# Altium schematic sheet Transceiver.SchDoc
size A3; Address1: Address1; Address2: Address2; Address3: Address3; Address4: Address4
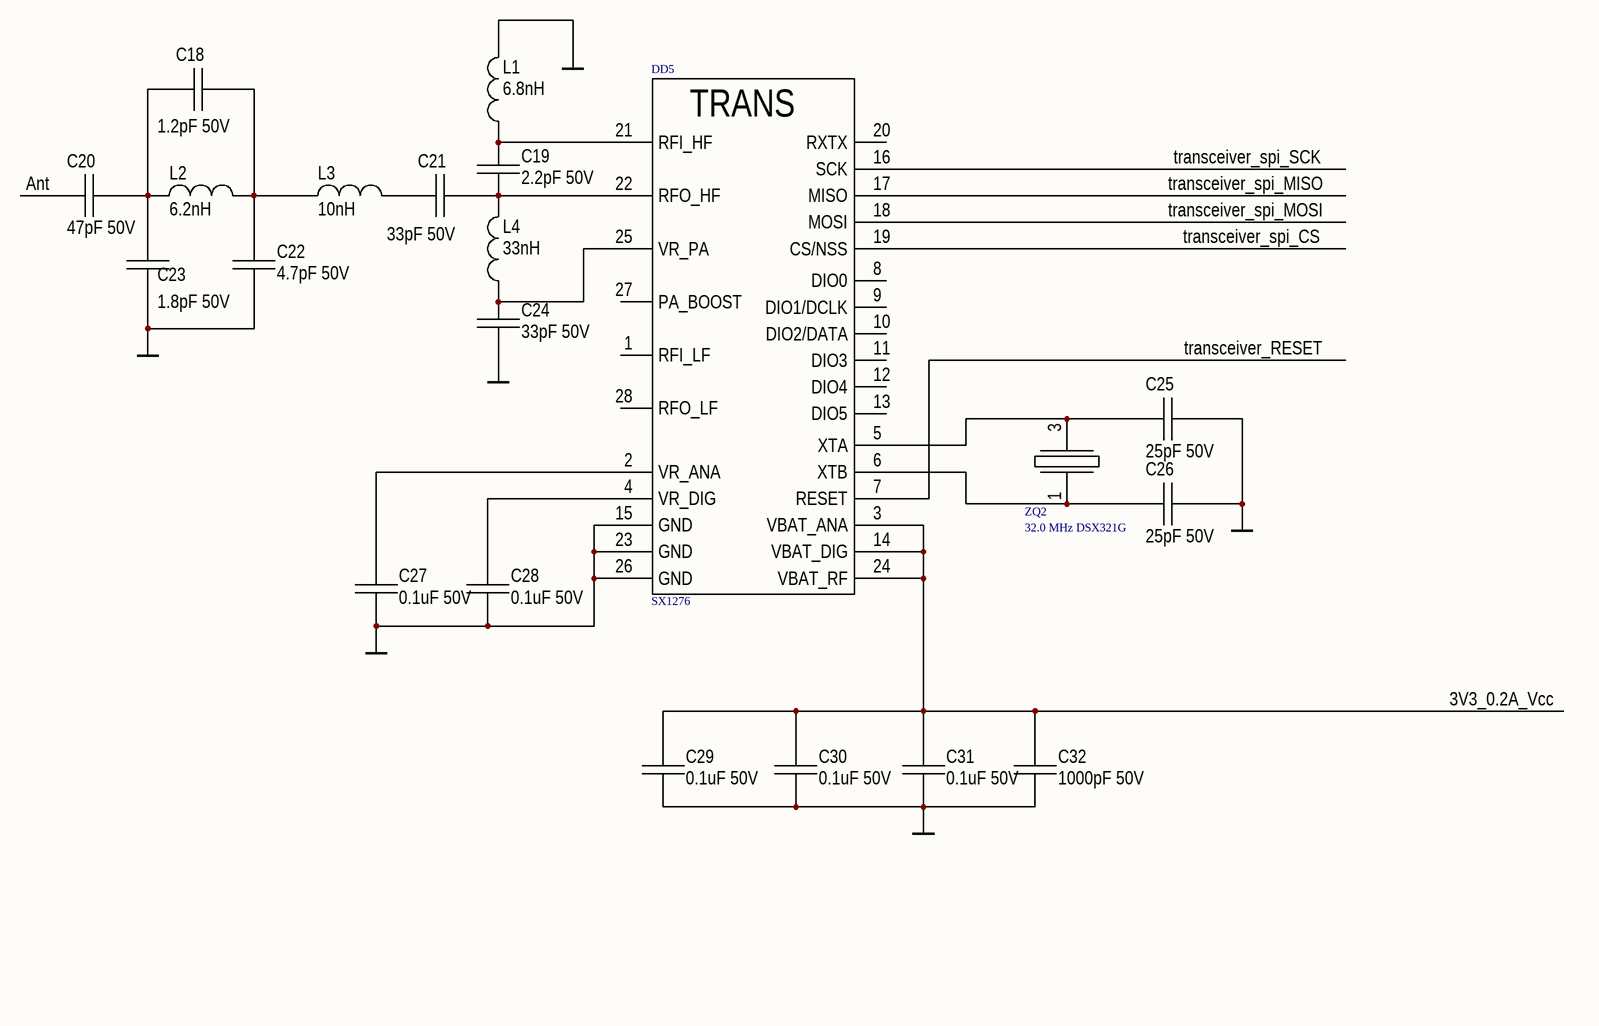
[diagram p0: Transceiver.SchDoc]

## Parts
C18  1.2pF 50V  [0603_CAP]
C19  2.2pF 50V  [0603_CAP]
C20  47pF 50V  [0603_CAP]
C21  33pF 50V  [0603_CAP]
C22  4.7pF 50V  [0603_CAP]
C23  1.8pF 50V  [0603_CAP]
C24  33pF 50V  [0603_CAP]
C25  25pF 50V  [0805_CAP]
C26  25pF 50V  [0805_CAP]
C27  0.1uF 50V  [0805_CAP]
C28  0.1uF 50V  [0805_CAP]
C29  0.1uF 50V  [0805_CAP]
C30  0.1uF 50V  [0805_CAP]
C31  0.1uF 50V  [0805_CAP]
C32  1000pF 50V  [0805_CAP]
DD5  SX1276  [qfn28]
L1  6.8nH  [0603_ind]
L2  6.2nH  [0603_ind]
L3  10nH  [0603_ind]
L4  33nH  [0603_ind]
ZQ2  32.0 MHz DSX321G  [gtxo-93]

## Nets
GND: C22.2 C23.1 C24.2 C25.2 C26.2 C27.1 C28.2 C29.2 C30.2 C31.2 C32.2 DD5.15(GND) DD5.23(GND) DD5.26(GND) L1.2
3V3_0.2A_Vcc: C29.1 C30.1 C31.1 C32.1 DD5.3(VBAT_ANA) DD5.14(VBAT_DIG) DD5.24(VBAT_RF)
Ant: C20.2
transceiver_RESET: DD5.7(RESET)
transceiver_spi_CS: DD5.19(CS/NSS)
transceiver_spi_MISO: DD5.17(MISO)
transceiver_spi_MOSI: DD5.18(MOSI)
transceiver_spi_SCK: DD5.16(SCK)
NetC18_1: C18.1 C20.1 C23.2 L2.1
NetC18_2: C18.2 C22.1 L2.2 L3.1
NetC19_1: C19.1 C21.1 DD5.22(RFO_HF) L4.2
NetC19_2: C19.2 DD5.21(RFI_HF) L1.1
NetC21_2: C21.2 L3.2
NetC24_1: C24.1 DD5.25(VR_PA) L4.1
NetC25_1: C25.1 DD5.5(XTA) ZQ2.3
NetC26_1: C26.1 DD5.6(XTB) ZQ2.1
NetC27_2: C27.2 DD5.2(VR_ANA)
NetC28_1: C28.1 DD5.4(VR_DIG)

Not connected (* = marked no-connect by the designer): DD5 1(RFI_LF) 8(DIO0) 9(DIO1/DCLK) 10(DIO2/DATA) 11(DIO3) 12(DIO4) 13(DIO5) 20(RXTX) 27(PA_BOOST) 28(RFO_LF)

## Notes on the sheet
- На место компонента С6 запаивается перемычка
- Title
- Size:
- Date:
- A3
- Number:
- Time:
- Revision:
- Sheet
- of
- File:
- (in symbol SX1276) TRANS

## Library data of the parts
C18-C32 = Cap_np
  C18: Value: 1.2pF 50V
  C19: Value: 2.2pF 50V
  C20: Value: 47pF 50V
  C21 C24: Value: 33pF 50V
  C22: Value: 4.7pF 50V
  C23: Value: 1.8pF 50V
  C25 C26: Value: 25pF 50V
  C27-C31: Value: 0.1uF 50V
  C32: Value: 1000pF 50V
L1-L4 = Inductor
  L1: Value: 6.8nH
  L2: Value: 6.2nH
  L3: Value: 10nH
  L4: Value: 33nH
ZQ2 = Cristall: Value: 32.0 MHz DSX321G
DD5 = SX1276: Value: SX1276